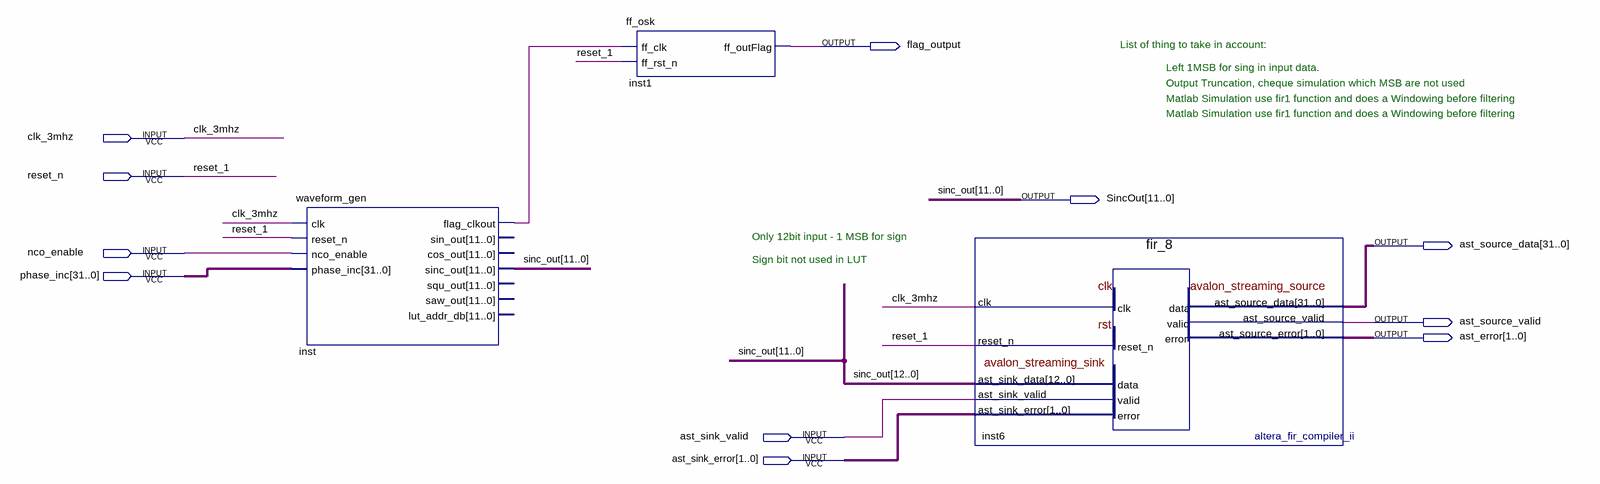
[diagram p0: schematic sheet]
// Quartus schematic lut_fir.bdf as structural Verilog: 3 symbols, 11 pins
module lut_fir (
  input  clk_3mhz,
  input  reset_n,
  input  nco_enable,
  input  [31:0] phase_inc,
  input  ast_sink_valid,
  input  [1:0] ast_sink_error,
  output flag_output,
  output [11:0] SincOut,
  output [31:0] ast_source_data,
  output ast_source_valid,
  output [1:0] ast_error
);

  wire inst_flag_clkout;
  wire [12:12] sinc_out;

  waveform_gen inst (
    .clk(clk_3mhz), .reset_n(reset_n), .nco_enable(nco_enable), .phase_inc(phase_inc),
    .flag_clkout(inst_flag_clkout), .sinc_out(SincOut));  // open: sin_out, cos_out, squ_out, saw_out, lut_addr_db
  ff_osk inst1 (.ff_clk(inst_flag_clkout), .ff_rst_n(reset_n), .ff_outFlag(flag_output));
  fir_8 inst6 (
    .clk(clk_3mhz), .reset_n(reset_n), .ast_sink_data({sinc_out[12], SincOut}),
    .ast_sink_valid(ast_sink_valid), .ast_sink_error(ast_sink_error), .ast_source_data(ast_source_data),
    .ast_source_valid(ast_source_valid), .ast_source_error(ast_error));

  // Other names for the same wires on the sheet: reset_1 = reset_n; sinc_out[11:0] = SincOut

  // Notes on the sheet:
  //   List of thing to take in account:
  //   Left 1MSB for sing in input data.
  //   Output Truncation, cheque simulation which MSB are not used
  //   Matlab Simulation use fir1 function and does a Windowing before filtering
  //   Matlab Simulation use fir1 function and does a Windowing before filtering
  //   Only 12bit input - 1 MSB for sign
  //   Sign bit not used in LUT
endmodule
